# Altium project TIDA-010086_mod.PrjPcb (part 8 of 11)

## Sheet XTIDA-010086_Bias Power Supply.SchDoc: Control card
size 431 x 279 mm; Date: Not shown in title block; ApprovedBy: Not shown in title block; CheckedBy: Not shown in title block; Author: Not shown in title block; CompanyName: Not shown in title block; DrawnBy: Jeff Xie; Engineer: Not shown in title block; Organization: Not shown in title block; Address1: Not shown in title block; Address2: Not shown in title block; Address3: Not shown in title block; Address4: Not shown in title block; DocumentNumber: 2; Revision: Use project parameter SCH_Rev; SheetNumber: 7; SheetTotal: 8; PageSetup: Record=PageOptions|CenterHorizontal=True|CenterVertical=True|PrintScale=1.00|XCorrection=1.00|YCorrection=1.00|PrintKind=0|BorderSize=5000000|LeftOffset=0|BottomOffset=0|Orientation=2|PaperLength=1000|PaperWidth=1000|Scale=100|PaperSource=15|PrintQuality=600|MediaType=1|DitherType=10|PaperKind=Letter|PrintScaleMode=1; CurrentTime: Not shown in title block; CurrentDate: Not shown in title block; Time: Not shown in title block; DocumentFullPathAndName: Not shown in title block; DocumentName: Not shown in title block; ModifiedDate: Not shown in title block; ImagePath: Not shown in title block
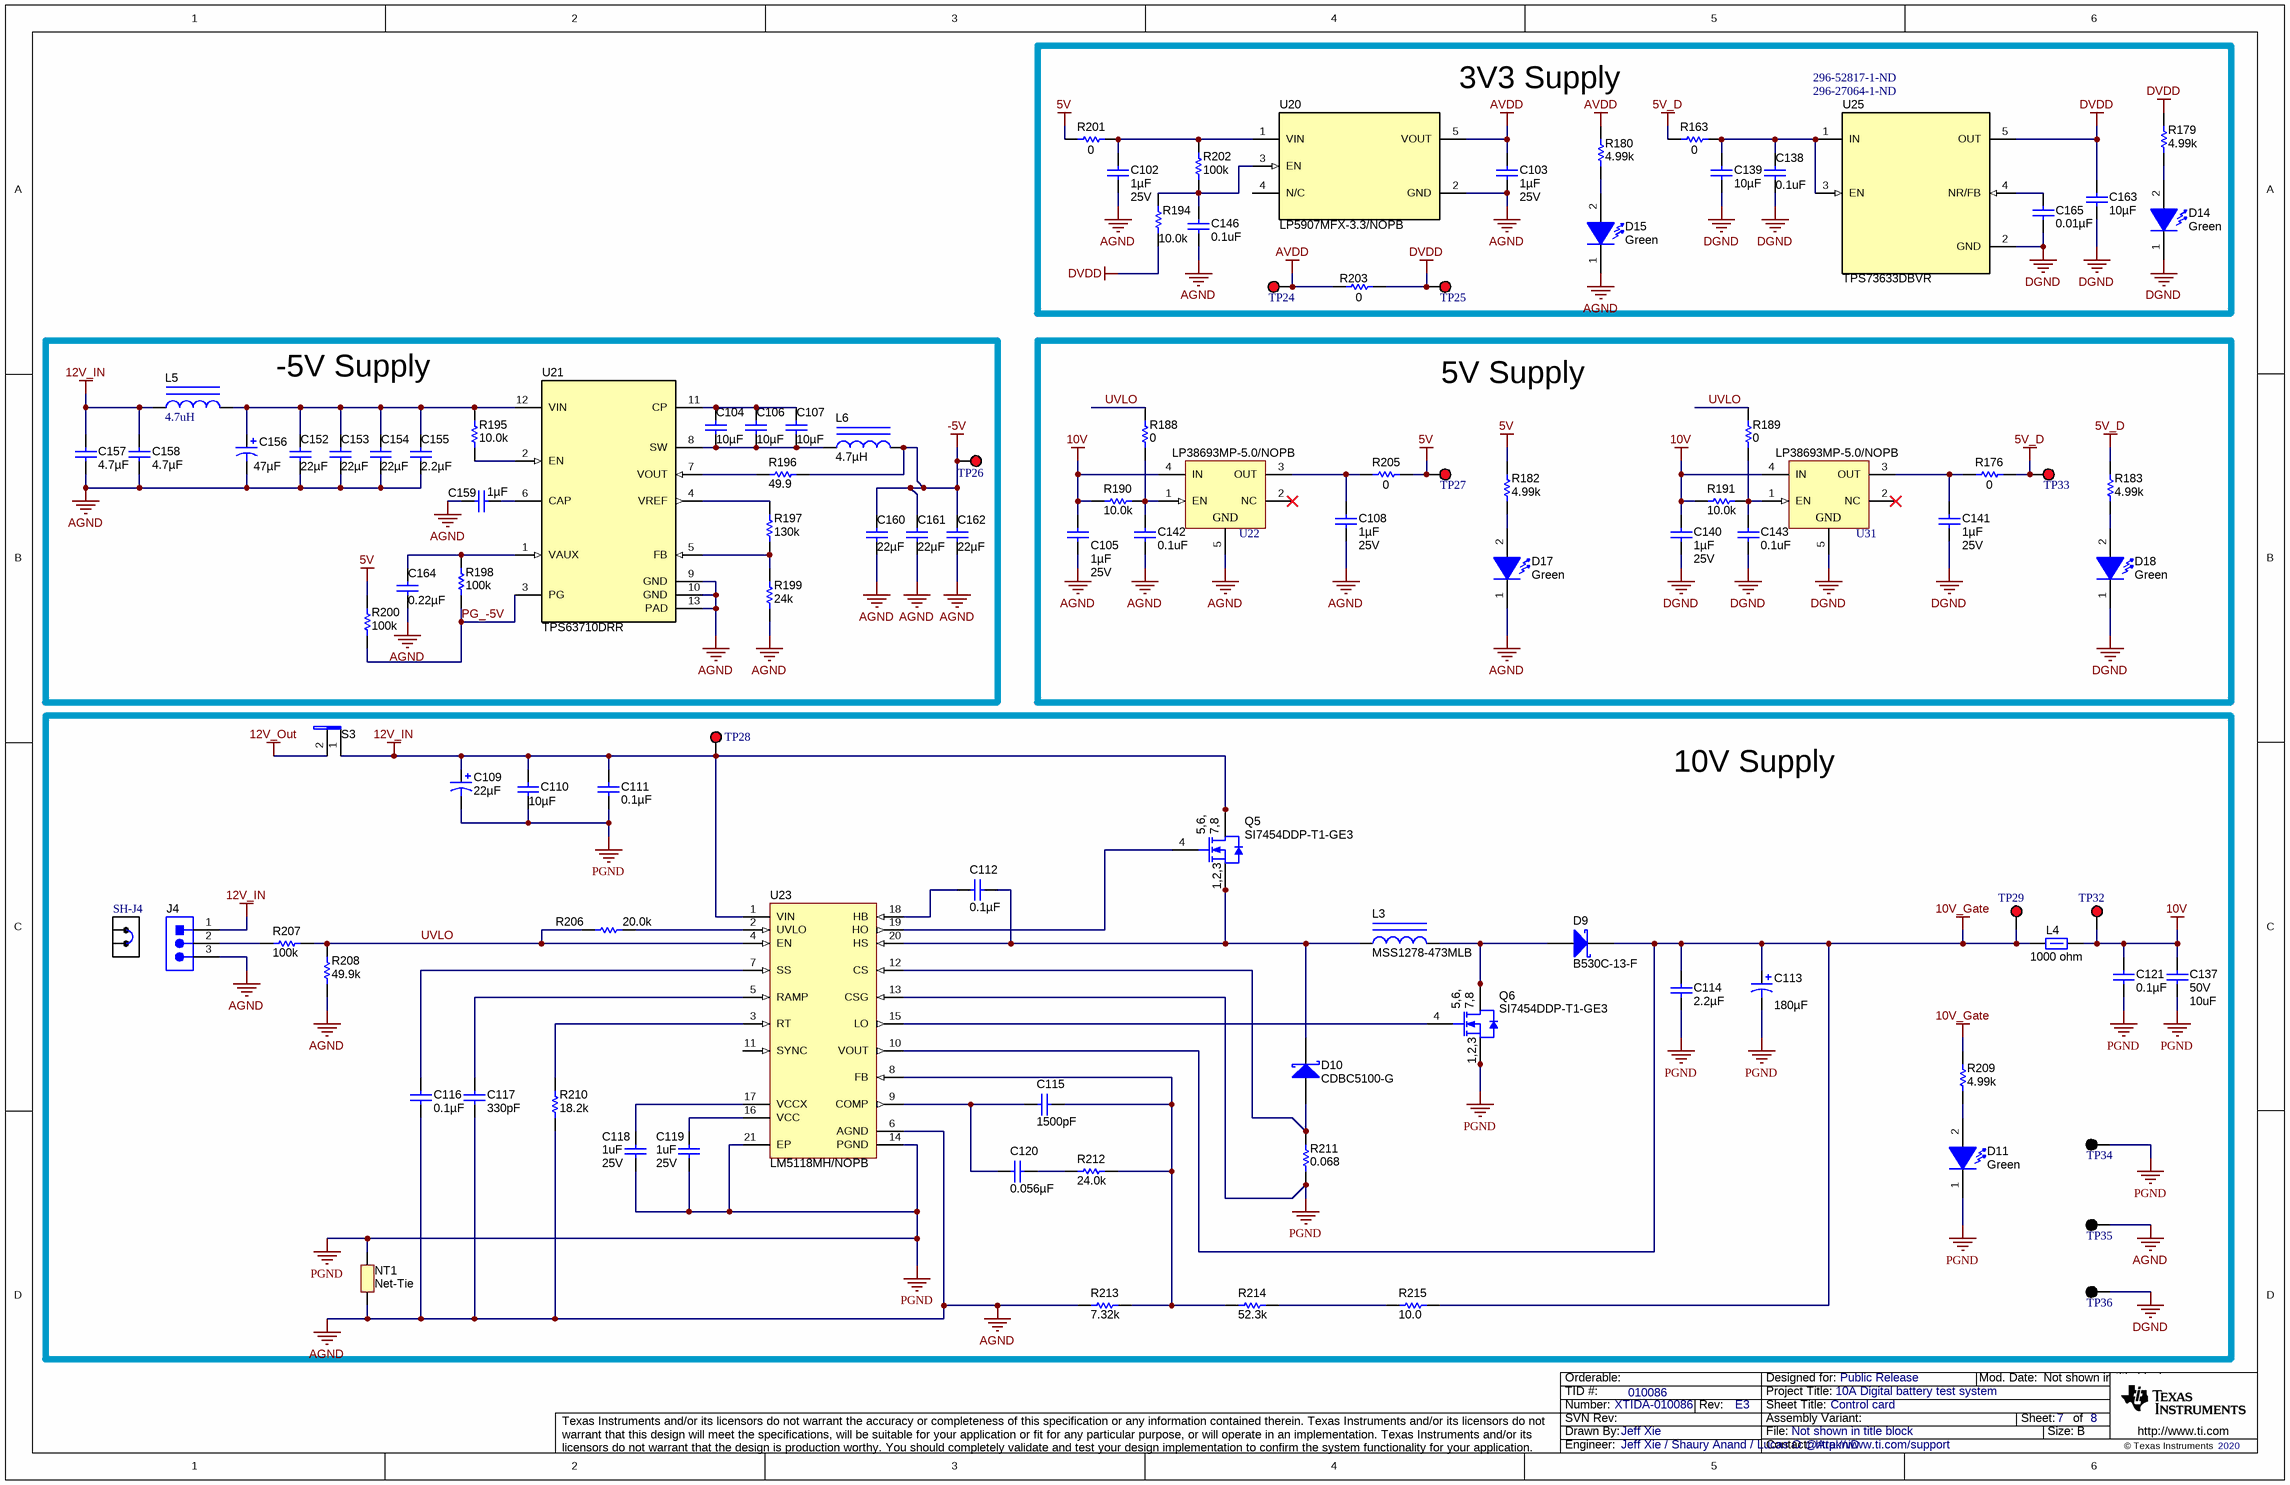
[diagram p13: XTIDA-010086_Bias Power Supply.SchDoc]

### Parts
C102  Cap_F: 1µF  VDC_V: 25V  [0603]  (hidden comment: GRM188R71E105KA12D)
C103  Cap_F: 1µF  VDC_V: 25V  [0603]  (hidden comment: GRM188R71E105KA12D)
C104  ValueDisplayed: 10µF  [0805_HV1]  (hidden comment: EMK212BB7106MG-T)
C105  Cap_F: 1µF  VDC_V: 25V  [0603]  (hidden comment: GRM188R71E105KA12D)
C106  ValueDisplayed: 10µF  [0805_HV1]  (hidden comment: EMK212BB7106MG-T)
C107  ValueDisplayed: 10µF  [0805_HV1]  (hidden comment: EMK212BB7106MG-T)
C108  Cap_F: 1µF  VDC_V: 25V  [0603]  (hidden comment: GRM188R71E105KA12D)
C109  ValueDisplayed: 22µF  [CAPSMT_62_JA0]  (hidden comment: EMVH101ADA220MJA0G)
C110  ValueDisplayed: 10µF  [2220_250]  (hidden comment: C5750X7S2A106M230KB)
C111  ValueDisplayed: 0.1µF  [0805_HV]  (hidden comment: C2012X7R2A104K125AA)
C112  ValueDisplayed: 0.1µF  [0603L]  (hidden comment: GRM188R72A104KA35D)
C113  ValueDisplayed: 180µF  [CAPSMT_62_HC0]  (hidden comment: APXA160ARA181MHC0G)
C114  ValueDisplayed: 2.2µF  [0805_HV]  (hidden comment: C2012X7R1C225K125AB)
C115  ValueDisplayed: 1500pF  [0603L]  (hidden comment: GRM1885C2A152JA01D)
C116  ValueDisplayed: 0.1µF  [0603L]  (hidden comment: GRM188R72A104KA35D)
C117  ValueDisplayed: 330pF  [0603L]  (hidden comment: C1608C0G2A331J080AA)
C118  ValueDisplayed: 1uF  VDC_V: 25V  [0603]  (hidden comment: GRM188R71E105KA12D)
C119  ValueDisplayed: 1uF  VDC_V: 25V  [0603]  (hidden comment: GRM188R71E105KA12D)
C120  ValueDisplayed: 0.056µF  [0603L]  (hidden comment: GRM188R71H563KA93D)
C121  ValueDisplayed: 0.1µF  [0805_HV]  (hidden comment: C2012X7R2A104K125AA)
C137  VDC_V: 50V  ValueDisplayed: 10uF  [1210_280]  (hidden comment: C3225X7R1H106M250AC)
C138  ValueDisplayed: 0.1uF  [0603]  (hidden comment: 06033C104JAT2A)
C139  ValueDisplayed: 10µF  [0603]  (hidden comment: GRM188R61E106MA73D)
C140  Cap_F: 1µF  VDC_V: 25V  [0603]  (hidden comment: GRM188R71E105KA12D)
C141  Cap_F: 1µF  VDC_V: 25V  [0603]  (hidden comment: GRM188R71E105KA12D)
C142  ValueDisplayed: 0.1uF  [0603]  (hidden comment: 06033C104JAT2A)
C143  ValueDisplayed: 0.1uF  [0603]  (hidden comment: 06033C104JAT2A)
C146  ValueDisplayed: 0.1uF  [0603]  (hidden comment: 06033C104JAT2A)
C152  ValueDisplayed: 22µF  [1206_190]  (hidden comment: EMK316BB7226ML-T)
C153  ValueDisplayed: 22µF  [1206_190]  (hidden comment: EMK316BB7226ML-T)
C154  ValueDisplayed: 22µF  [1206_190]  (hidden comment: EMK316BB7226ML-T)
C155  ValueDisplayed: 2.2µF  [0603_HV]  (hidden comment: EMK107BB7225KA-T)
C156  ValueDisplayed: 47µF  [F95_B]  (hidden comment: F951C476MBAAQ2)
C157  ValueDisplayed: 4.7µF  [1206]  (hidden comment: GRM319R61E475KA12D)
C158  ValueDisplayed: 4.7µF  [1206]  (hidden comment: GRM319R61E475KA12D)
C159  ValueDisplayed: 1µF  [0402]  (hidden comment: C1005X5R1C105K050BC)
C160  ValueDisplayed: 22µF  [0805_HV1]  (hidden comment: C2012X7S1A226M125AC)
C161  ValueDisplayed: 22µF  [0805_HV1]  (hidden comment: C2012X7S1A226M125AC)
C162  ValueDisplayed: 22µF  [0805_HV1]  (hidden comment: C2012X7S1A226M125AC)
C163  ValueDisplayed: 10µF  [0603]  (hidden comment: GRM188R61E106MA73D)
C164  ValueDisplayed: 0.22µF  [0402]  (hidden comment: GRM155R71C224KA12D)
C165  ValueDisplayed: 0.01µF  [0603]  (hidden comment: 06031C103KAT2A)
D9  B530C-13-F  [SMC]
D10  CDBC5100-G  [SMC]
D11  value Green  [WL-SMCW_GREEN]  (hidden comment: 150060VS75000)
D14  value Green  [WL-SMCW_GREEN]  (hidden comment: 150060VS75000)
D15  value Green  [WL-SMCW_GREEN]  (hidden comment: 150060VS75000)
D17  value Green  [WL-SMCW_GREEN]  (hidden comment: 150060VS75000)
D18  value Green  [WL-SMCW_GREEN]  (hidden comment: 150060VS75000)
J4  0022284033  [Molex_0022284033]  (value not drawn)
L3  MSS1278-473MLB  [mss1278]
L4  value 1000 ohm  [1806_HighSpeed]  (hidden comment: BLM41PG102SN1L)
L5  ValueDisplayed: 4.7uH  [MAKK2016]  (hidden comment: MAKK2016T4R7M)
L6  ValueDisplayed: 4.7µH  [XFL4020]  (hidden comment: XFL4020-472MEB)
NT1  Net-Tie  [Net-Tie_10mil]  (net tie, no BOM)
Q5  SI7454DDP-T1-GE3  [PowerPAK_SO-8]
Q6  SI7454DDP-T1-GE3  [PowerPAK_SO-8]
R163  ValueDisplayed: 0  [0603]  (hidden comment: CRCW06030000Z0ED)
R176  ValueDisplayed: 0  [0603]  (hidden comment: CRCW06030000Z0ED)
R179  ValueDisplayed: 4.99k  [0603L]  (hidden comment: CRCW06034K99FKEA)
R180  ValueDisplayed: 4.99k  [0603L]  (hidden comment: CRCW06034K99FKEA)
R182  ValueDisplayed: 4.99k  [0603L]  (hidden comment: CRCW06034K99FKEA)
R183  ValueDisplayed: 4.99k  [0603L]  (hidden comment: CRCW06034K99FKEA)
R188  ValueDisplayed: 0  [0402]  (hidden comment: CRCW04020000Z0ED)
R189  ValueDisplayed: 0  [0402]  (hidden comment: CRCW04020000Z0ED)
R190  ValueDisplayed: 10.0k  [0603]  (hidden comment: RC0603FR-0710KL)
R191  ValueDisplayed: 10.0k  [0603]  (hidden comment: RC0603FR-0710KL)
R194  ValueDisplayed: 10.0k  [0603]  (hidden comment: RC0603FR-0710KL)
R195  ValueDisplayed: 10.0k  [0603]  (hidden comment: RC0603FR-0710KL)
R196  ValueDisplayed: 49.9  [0402]  (hidden comment: CRCW040249R9FKED)
R197  ValueDisplayed: 130k  [0402]  (hidden comment: CRCW0402130KFKED)
R198  ValueDisplayed: 100k  [0402]  (hidden comment: CRCW0402100KDHEDP)
R199  ValueDisplayed: 24k  [0402]  (hidden comment: CRCW040224K0JNED)
R200  ValueDisplayed: 100k  [0402]  (hidden comment: CRCW0402100KDHEDP)
R201  ValueDisplayed: 0  [0603]  (hidden comment: CRCW06030000Z0ED)
R202  ValueDisplayed: 100k  [0603]  (hidden comment: CRCW0603100KFKEA)
R203  ValueDisplayed: 0  [0603]  (hidden comment: CRCW06030000Z0ED)
R205  ValueDisplayed: 0  [0603]  (hidden comment: CRCW06030000Z0ED)
R206  ValueDisplayed: 20.0k  [0603L]  (hidden comment: CRCW060320K0FKEA)
R207  ValueDisplayed: 100k  [0603]  (hidden comment: RC0603FR-07100KL)
R208  ValueDisplayed: 49.9k  [0603]  (hidden comment: CRCW060349K9FKEA)
R209  ValueDisplayed: 4.99k  [0603L]  (hidden comment: CRCW06034K99FKEA)
R210  ValueDisplayed: 18.2k  [0603L]  (hidden comment: CRCW060318K2FKEA)
R211  ValueDisplayed: 0.068  [0612]  (hidden comment: PRL1632-R068-F-T1)
R212  ValueDisplayed: 24.0k  [0603L]  (hidden comment: RC0603FR-0724KL)
R213  ValueDisplayed: 7.32k  [0603]  (hidden comment: RC0603FR-077K32L)
R214  ValueDisplayed: 52.3k  [0603]  (hidden comment: RC0603FR-0752K3L)
R215  ValueDisplayed: 10.0  [0603L]  (hidden comment: CRCW060310R0FKEA)
S3  L101011MS02Q  [SW_ L101011MS02Q]  (value not drawn)
SH-J4  60900213421  [Wurth_60900213421]  (value not drawn)
TP24  5000  [Keystone5000]  (value not drawn)
TP25  5000  [Keystone5000]  (value not drawn)
TP26  5000  [Keystone5000]  (value not drawn)
TP27  5000  [Keystone5000]  (value not drawn)
TP28  5000  [Keystone5000]  (value not drawn)
TP29  5000  [Keystone5000]  (value not drawn)
TP32  5000  [Keystone5000]  (value not drawn)
TP33  5000  [Keystone5000]  (value not drawn)
TP34  5001  [Keystone5001]  (value not drawn)
TP35  5001  [Keystone5001]  (value not drawn)
TP36  5001  [Keystone5001]  (value not drawn)
U20  LP5907MFX-3.3/NOPB  [DBV0005A_N]
U21  TPS63710DRR  [DRR0012C]
U22  LP38693MP-5.0/NOPB  [NDC0005A_N]
U23  LM5118MH/NOPB  [MXA20A_N]
U25  Supplier Part Number 1: 296-27064-1-ND  Supplier Part Number 2: 296-52817-1-ND  [DBV0005A_N]  (hidden comment: TPS73633DBVR)
U31  LP38693MP-5.0/NOPB  [NDC0005A_N]

### Nets
5V: R182.1 R200.2 R201.1 R205.2 TP27.1
5V_D: R163.1 R176.2 R183.1 TP33.1
10V: C105.1 C121.1 C137.1 C140.1 L4.2 R190.2 R191.2 TP32.1 U22.4(IN) U31.4(IN)
10V_Gate: C113.1(+) C114.1 D9.1(K) L4.1 R209.1 R215.2 TP29.1 U23.10(VOUT)
12V_IN: C109.1(+) C110.1 C111.1 C157.1 C158.1 J4.1 L5.1 Q5.5(D) Q5.6(D) Q5.7(D) Q5.8(D) Q5.9(D) S3.1 TP28.1 U23.1(VIN)
12V_Out: S3.2
-5V: C160.1 C161.1 C162.1 L6.2 R196.1 TP26.1
AGND: C102.2 C103.2 C105.2 C108.2 C116.2 C117.2 C142.2 C146.2 C152.2 C153.2 C154.2 C155.2 C156.2(-) C157.2 C158.2 C159.1 C160.2 C161.2 C162.2 C164.2 D15.1(K) D17.1(K) J4.3 NT1.1 R199.1 R208.1 R210.1 R213.1 TP35.1 U20.2(GND) U21.9(GND) U21.10(GND) U21.13(PAD) U22.5(GND) U23.6(AGND)
AVDD: C103.1 R180.1 R203.1 TP24.1 U20.5(VOUT)
DGND: C138.2 C139.2 C140.2 C141.2 C143.2 C163.2 C165.2 D14.1(K) D18.1(K) TP36.1 U25.2(GND) U31.5(GND)
DVDD: C163.1 R179.1 R194.1 R203.2 TP25.1 U25.5(OUT)
PGND: C109.2(-) C110.2 C111.2 C113.2(-) C114.2 C118.2 C119.2 C121.2 C137.2 D11.1(K) NT1.2 Q6.1(S) Q6.2(S) Q6.3(S) R211.1 TP34.1 U23.13(CSG) U23.14(PGND) U23.21(EP)
PG_-5V: R198.1 R200.1 U21.3(PG)
UVLO: R188.1 R189.1 R206.1 R207.1 R208.2 U23.4(EN)
NetC102_1: C102.1 R201.2 R202.2 U20.1(VIN)
NetC104_1: C104.1 C106.1 C107.1 U21.11(CP)
NetC104_2: C104.2 C106.2 C107.2 L6.1 U21.8(SW)
NetC108_1: C108.1 R205.1 U22.3(OUT)
NetC112_1: C112.1 D10.1(K) L3.1 Q5.1(S) Q5.2(S) Q5.3(S) U23.20(HS)
NetC112_2: C112.2 U23.18(HB)
NetC115_1: C115.1 C120.1 U23.9(COMP)
NetC115_2: C115.2 R212.1 R213.2 R214.1 U23.8(FB)
NetC116_1: C116.1 U23.7(SS)
NetC117_1: C117.1 U23.5(RAMP)
NetC118_1: C118.1 U23.17(VCCX)
NetC119_1: C119.1 U23.16(VCC)
NetC120_2: C120.2 R212.2
NetC138_1: C138.1 C139.1 R163.2 U25.1(IN) U25.3(EN)
NetC141_1: C141.1 R176.1 U31.3(OUT)
NetC142_1: C142.1 R188.2 R190.1 U22.1(EN)
NetC143_1: C143.1 R189.2 R191.1 U31.1(EN)
NetC146_1: C146.1 R194.2 R202.1 U20.3(EN)
NetC152_1: C152.1 C153.1 C154.1 C155.1 C156.1(+) L5.2 R195.1 U21.12(VIN)
NetC159_2: C159.2 U21.6(CAP)
NetC164_1: C164.1 R198.2 U21.1(VAUX)
NetC165_1: C165.1 U25.4(NR/FB)
NetD9_2: D9.2(A) L3.2 Q6.5(D) Q6.6(D) Q6.7(D) Q6.8(D) Q6.9(D)
NetD10_2: D10.2(A) R211.2 U23.12(CS)
NetD11_2: D11.2(A) R209.2
NetD14_2: D14.2(A) R179.2
NetD15_2: D15.2(A) R180.2
NetD17_2: D17.2(A) R182.2
NetD18_2: D18.2(A) R183.2
NetJ4_2: J4.2 R207.2
NetQ5_4: Q5.4(G) U23.19(HO)
NetQ6_4: Q6.4(G) U23.15(LO)
NetR195_2: R195.2 U21.2(EN)
NetR196_2: R196.2 U21.7(VOUT)
NetR197_1: R197.1 R199.2 U21.5(FB)
NetR197_2: R197.2 U21.4(VREF)
NetR206_2: R206.2 U23.2(UVLO)
NetR210_2: R210.2 U23.3(RT)
NetR214_2: R214.2 R215.1

Not connected (* = marked no-connect by the designer): U20 4(N/C); U22 2(NC)*; U23 11(SYNC); U31 2(NC)*

### Notes on the sheet
- 3V3 Supply
- -5V Supply
- (near R189) 5V Supply
- 10V Supply
- Drawn By:
- SVN Rev:
- Number:
- TID #:
- Orderable:
- Rev:
- Sheet Title:
- File:
- Project Title:
- Designed for:
- Assembly Variant:
- Mod. Date:
- Sheet:
- Size:
- of
- B
- http://www.ti.com
- Texas Instruments and/or its licensors do not warrant the accuracy or completeness of this specification or any information contained therein. Texas Instruments and/or its licensors do not warrant that this design will meet the specifications, will be suitable for your application or fit for any particular purpose, or will operate in an implementation. Texas Instruments and/or its licensors do not warrant that the design is production worthy. You should completely validate and test your design implementation to confirm the system functionality for your application.
- Engineer:
- Contact:
- © Texas Instruments
- (in symbol SI7454DDP-T1-GE3) 5,6,; 7,8; 1,2,3